# EAGLE schematic tca_demo1 (EAGLE 9.3.2)
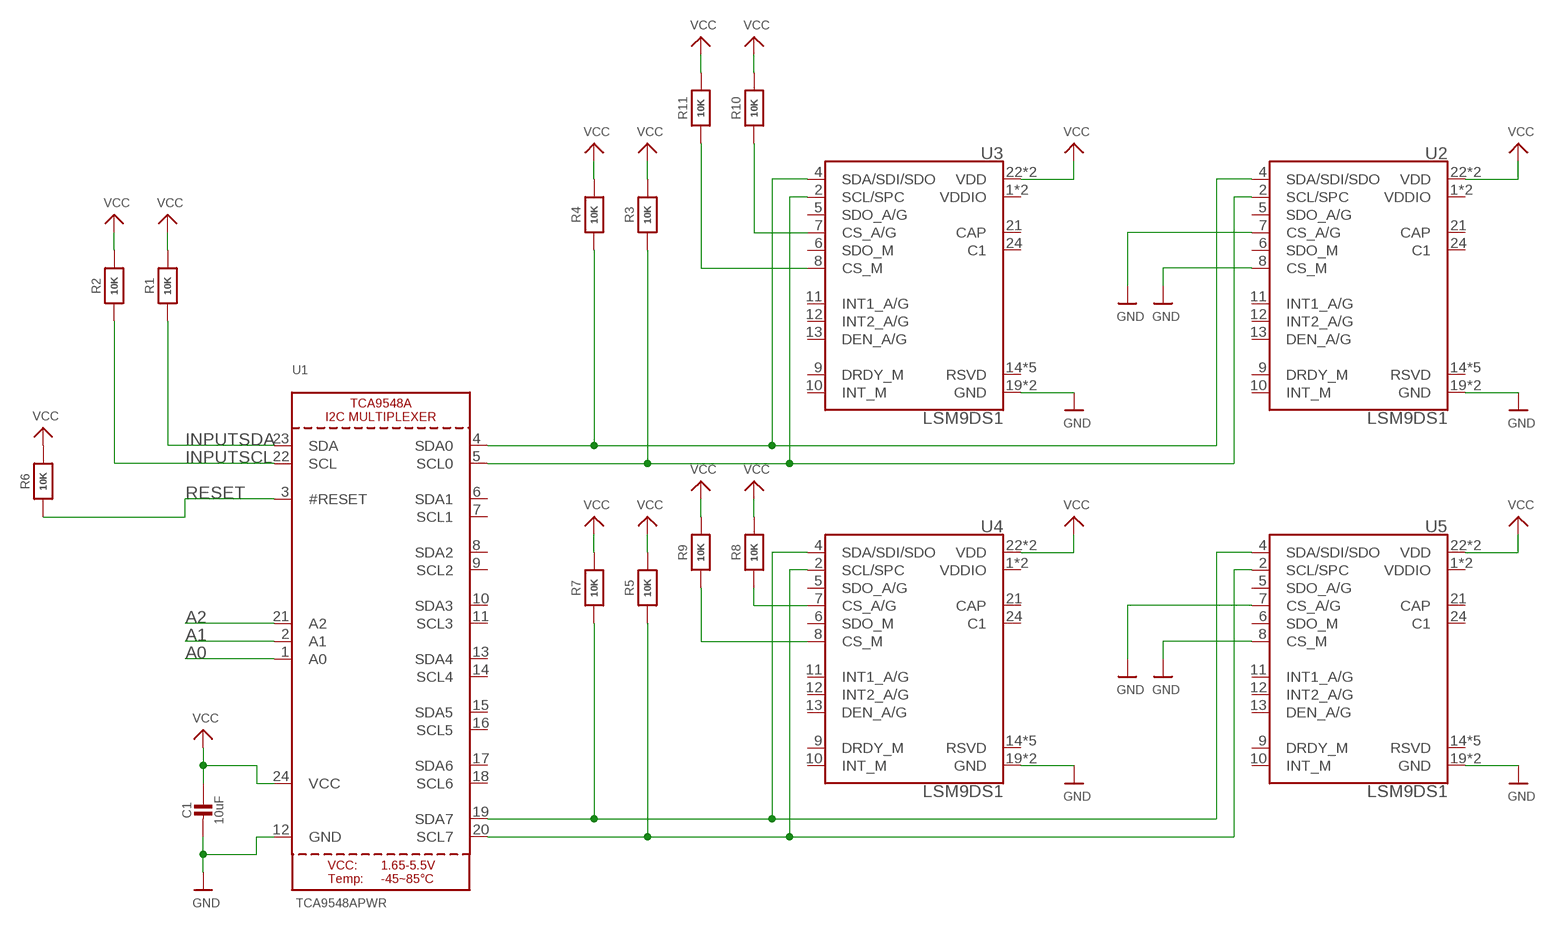
[diagram p0: schematic, sheet 1]

## Parts
C1  10uF  CAP_CERAMIC0805-NOOUTLINE  [0805-NO]
R1  10K  RESISTOR0805_NOOUTLINE  [0805-NO]
R2  10K  RESISTOR0805_NOOUTLINE  [0805-NO]
R3  10K  RESISTOR0805_NOOUTLINE  [0805-NO]
R4  10K  RESISTOR0805_NOOUTLINE  [0805-NO]
R5  10K  RESISTOR0805_NOOUTLINE  [0805-NO]
R6  10K  RESISTOR_0805MP  [_0805MP]
R7  10K  RESISTOR0805_NOOUTLINE  [0805-NO]
R8  10K  RESISTOR0805_NOOUTLINE  [0805-NO]
R9  10K  RESISTOR0805_NOOUTLINE  [0805-NO]
R10  10K  RESISTOR0805_NOOUTLINE  [0805-NO]
R11  10K  RESISTOR0805_NOOUTLINE  [0805-NO]
U1  TCA9548APWR  TCA9548A  [TSSOP24]
U2  LSM9DS1  [LGA-24-3.5X3]
U3  LSM9DS1  [LGA-24-3.5X3]
U4  LSM9DS1  [LGA-24-3.5X3]
U5  LSM9DS1  [LGA-24-3.5X3]

## Nets
A0: U1.1(A0)
A1: U1.2(A1)
A2: U1.21(A2)
GND: C1.2 U1.12(GND) U2.7(CS_A/G) U2.8(CS_M) U2.19(GND) U2.20(GND) U3.19(GND) U3.20(GND) U4.19(GND) U4.20(GND) U5.7(CS_A/G) U5.8(CS_M) U5.19(GND) U5.20(GND)
INPUTSCL: R2.1 U1.22(SCL)
INPUTSDA: R1.1 U1.23(SDA)
N$1: R4.1 U1.4(SDA0) U2.4(SDA/SDI/SDO) U3.4(SDA/SDI/SDO)
N$2: R3.1 U1.5(SCL0) U2.2(SCL/SPC) U3.2(SCL/SPC)
N$3: R10.1 U3.7(CS_A/G)
N$4: R11.1 U3.8(CS_M)
N$5: R7.1 U1.19(SDA7) U4.4(SDA/SDI/SDO) U5.4(SDA/SDI/SDO)
N$6: R5.1 U1.20(SCL7) U4.2(SCL/SPC) U5.2(SCL/SPC)
N$7: R8.1 U4.7(CS_A/G)
N$8: R9.1 U4.8(CS_M)
RESET: R6.1 U1.3(#RESET)
VCC: C1.1 R1.2 R2.2 R3.2 R4.2 R5.2 R6.2 R7.2 R8.2 R9.2 R10.2 R11.2 U1.24(VCC) U2.22(VDD) U2.23(VDD) U3.22(VDD) U3.23(VDD) U4.22(VDD) U4.23(VDD) U5.22(VDD) U5.23(VDD)
Unconnected: U1.6(SDA1) U1.7(SCL1) U1.8(SDA2) U1.9(SCL2) U1.10(SDA3) U1.11(SCL3) U1.13(SDA4) U1.14(SCL4) U1.15(SDA5) U1.16(SCL5) U1.17(SDA6) U1.18(SCL6) U2.1(VDDIO) U2.3(VDDIO) U2.5(SDO_A/G) U2.6(SDO_M) U2.9(DRDY_M) U2.10(INT_M) U2.11(INT1_A/G) U2.12(INT2_A/G) U2.13(DEN_A/G) U2.14(RSVD) U2.15(RSVD) U2.16(RSVD) U2.17(RSVD) U2.18(RSVD) U2.21(CAP) U2.24(C1) U3.1(VDDIO) U3.3(VDDIO) U3.5(SDO_A/G) U3.6(SDO_M) U3.9(DRDY_M) U3.10(INT_M) U3.11(INT1_A/G) U3.12(INT2_A/G) U3.13(DEN_A/G) U3.14(RSVD) U3.15(RSVD) U3.16(RSVD) U3.17(RSVD) U3.18(RSVD) U3.21(CAP) U3.24(C1) U4.1(VDDIO) U4.3(VDDIO) U4.5(SDO_A/G) U4.6(SDO_M) U4.9(DRDY_M) U4.10(INT_M) U4.11(INT1_A/G) U4.12(INT2_A/G) U4.13(DEN_A/G) U4.14(RSVD) U4.15(RSVD) U4.16(RSVD) U4.17(RSVD) U4.18(RSVD) U4.21(CAP) U4.24(C1) U5.1(VDDIO) U5.3(VDDIO) U5.5(SDO_A/G) U5.6(SDO_M) U5.9(DRDY_M) U5.10(INT_M) U5.11(INT1_A/G) U5.12(INT2_A/G) U5.13(DEN_A/G) U5.14(RSVD) U5.15(RSVD) U5.16(RSVD) U5.17(RSVD) U5.18(RSVD) U5.21(CAP) U5.24(C1)

## Library data of the parts
C1 = microbuilder:CAP_CERAMIC: Ceramic Capacitors For new designs, use the packages preceded by an '_' character since they are more reliable: The following footprints should be used on most boards: _0402 - Standard footprint for regular board layouts _0603 - Standard footprint for regular board layouts _0805 - Standard footprint for regular board layouts _1206 - Standard footprint for regular board layouts For extremely tight-pitch boards where space is at a premium, the following 'micro-pitch' footprints can be used (smaller pads, no silkscreen outline, etc.): _0402MP - Micro-pitch footprint for very dense/compact boards _0603MP - Micro-pitch footprint for very dense/compact boards _0805MP - Micro-pitch footprint for very dense/compact boards _1206MP - Micro-pitch footprint for very dense/compact boards
R1-R11 = microbuilder:RESISTOR: Resistors For new designs, use the packages preceded by an '_' character since they are more reliable: The following footprints should be used on most boards: _0402 - Standard footprint for regular board layouts _0603 - Standard footprint for regular board layouts _0805 - Standard footprint for regular board layouts _1206 - Standard footprint for regular board layouts For extremely tight-pitch boards where space is at a premium, the following 'micro-pitch' footprints can be used (smaller pads, no silkscreen outline, etc.): _0402MP - Micro-pitch footprint for very dense/compact boards _0603MP - Micro-pitch footprint for very dense/compact boards _0805MP - Micro-pitch footprint for very dense/compact boards _1206MP - Micro-pitch footprint for very dense/compact boards
U1 = microbuilder:TCA9548A: TCA9548A I2C Multiplexer
U2-U5 = SparkFun-Sensors:LSM9DS1: ST Microelectronics LSM9DS1 9DOF IMU - Accelerometer, Gyroscope & Magnetometer The LSM9DS1 is a versatile, motion-sensing system-in-a-chip. It houses a 3-axis accelerometer, 3-axis gyroscope, and 3-axis magnetometer – nine degrees of freedom (9DOF) in a single IC! The LSM9DS1 is equipped with a digital interface, but even that is flexible: it supports both I2C and SPI, so you’ll be hard-pressed to find a microcontroller it doesn’t work with. Datasheet <https://cdn.sparkfun.com/assets/learn_tutorials/3/7/3/LSM9DS1_Datasheet.pdf> SparkFun Products SparkFun 9 Degrees of Freedom IMU Breakout - LSM9DS1 <https://www.sparkfun.com/products/13284> (SEN-13284) SparkFun Photon IMU Shield <https://www.sparkfun.com/products/13629> (DEV-13629); PROD_ID: IC-12536